# Altium schematic sheet buck_boost.SchDoc
size A4; SheetNumber: 5; SheetTotal: 7
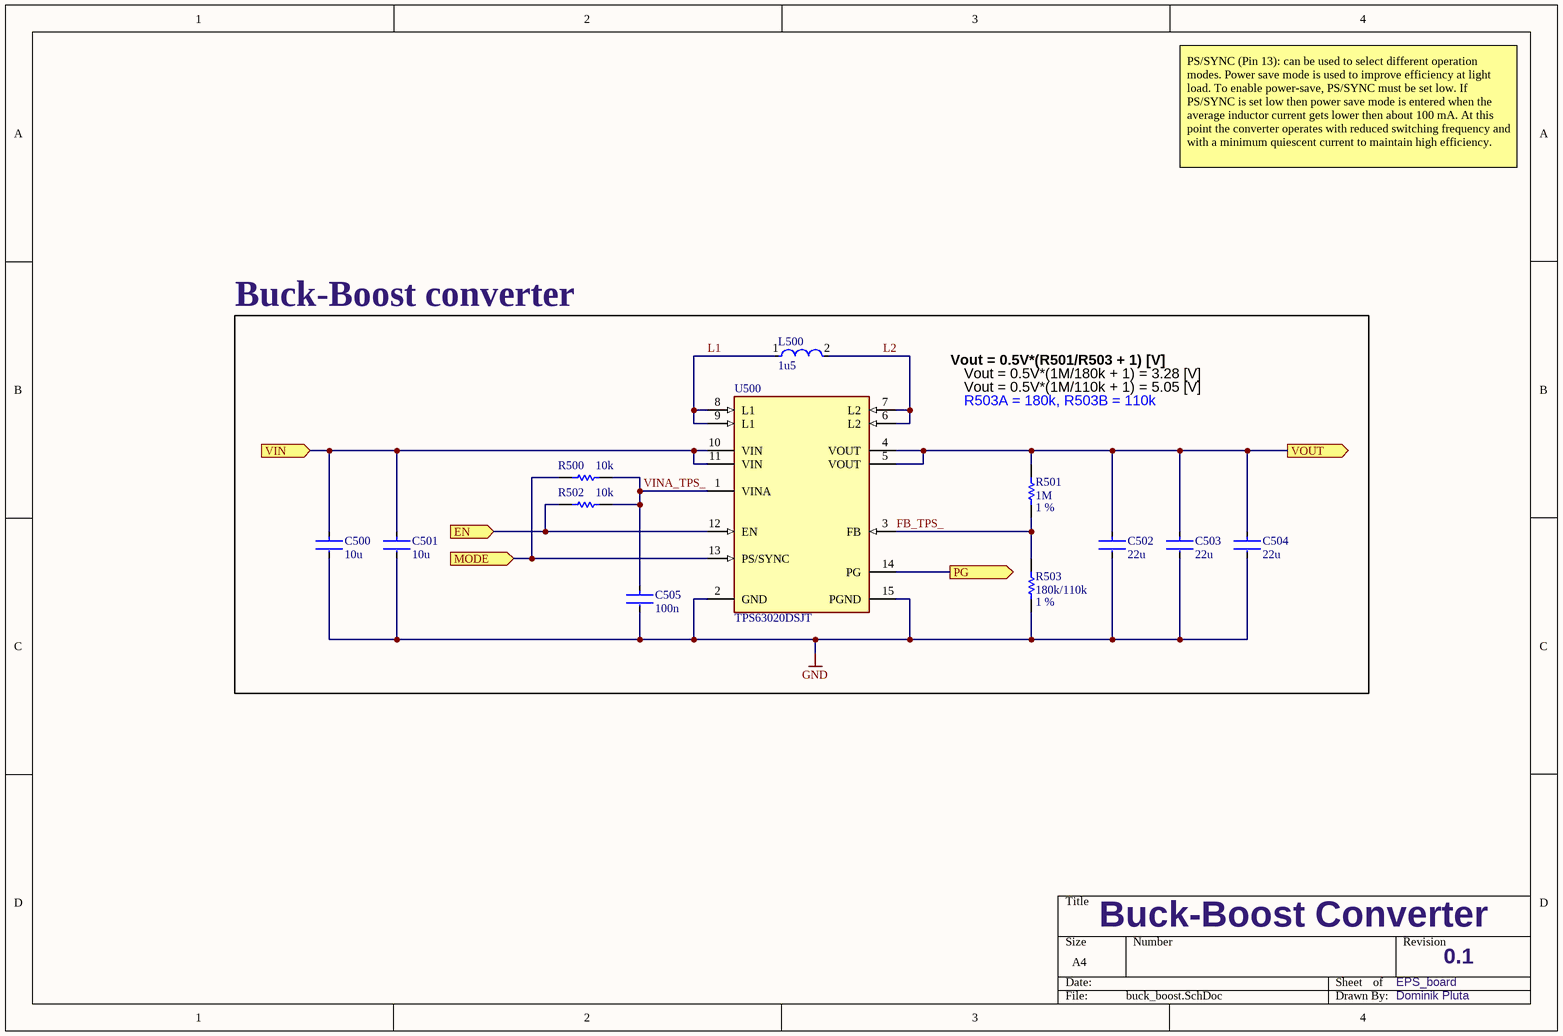
[diagram p0: buck_boost.SchDoc]

## Parts
C500  10u  [FP-C0603C-CF-MFG]
C501  10u  [FP-C0603C-CF-MFG]
C502  22u  [FP-C0603C-CF-MFG]
C503  22u  [FP-C0603C-CF-MFG]
C504  22u  [FP-C0603C-CF-MFG]
C505  100n  [FP-C0603C-CF-MFG]
L500  1u5  [FP-IHLP-1616BZ-FP_1_8545x-MFG]
R500  10k  [RESC0603(1608)_N]
R501  1M  Tolerance: 1 %  [RESC0603(1608)_N]
R502  10k  [RESC0603(1608)_N]
R503  180k/110k  Tolerance: 1 %  [RESC0603(1608)_N]
U500  TPS63020DSJT  [FP-DSJ0014A-MFG]

## Ports
EN (in, see EPS[3B]), MODE (in, see EPS[3B]), PG (out, see EPS[3B]), VIN (in, see EPS[3B]), VOUT (out, see EPS[3B])

## Nets
GND: C500.2 C501.2 C502.2 C503.2 C504.2 C505.2 R503.1 U500.2(GND) U500.15(PGND)
EN: R502.2 U500.12(EN) ; port EN
FB_TPS_: R501.1 R503.2 U500.3(FB)
L1: L500.1 U500.8(L1) U500.9(L1)
L2: L500.2 U500.6(L2) U500.7(L2)
MODE: R500.2 U500.13(PS/SYNC) ; port MODE
PG: U500.14(PG) ; port PG
VIN: C500.1 C501.1 U500.10(VIN) U500.11(VIN) ; port VIN
VINA_TPS_: C505.1 R500.1 R502.1 U500.1(VINA)
VOUT: C502.1 C503.1 C504.1 R501.2 U500.4(VOUT) U500.5(VOUT) ; port VOUT

## Notes on the sheet
- PS/SYNC (Pin 13): can be used to select different operation modes. Power save mode is used to improve efficiency at light load. To enable power-save, PS/SYNC must be set low. If PS/SYNC is set low then power save mode is entered when the average inductor current gets lower then about 100 mA. At this point the converter operates with reduced switching frequency and with a minimum quiescent current to maintain high efficiency.
- Buck-Boost converter
- Vout = 0.5V*(R501/R503 + 1) [V]
- Vout = 0.5V*(1M/180k + 1) = 3.28 [V]
- Vout = 0.5V*(1M/110k + 1) = 5.05 [V]
- R503A = 180k, R503B = 110k
- Buck-Boost Converter
- EPS_board
- 0.1
- Dominik Pluta

## Library data of the parts
C500 C501 = CMP-2006-03061-2: CAP 10 μF 20% 6.3V, 0603, X5R ceramic, eg: GRM188R60J106ME84D; Manufacturer: MURATA; Voltage Rating: 6V3; Capacitance: 10 μF; Tolerance: 20%; Temperature: -55°C to +85°C; RoHS: TRUE; Material: Ceramic; Category: Cap; Package: 0603; ComponentLink2Description: Datasheet; Device Class L1: Passive Components; Device Class L3: Ceramic Capacitors; ComponentLink2URL: https://api.kemet.com/component-edge/download/datasheet/C0603C100J5GACAUTO.pdf; Device Class L2: Capacitors; Manufacturer-part-number: GRM188R60J106ME84D; Temperature Characteristic: X5R
C502-C504 = CMP-2006-03061-2: CAP 22 μF 20% 6.3V, 0603, X5R ceramic, eg: GRM188R60J226MEAOL; Manufacturer: MURATA; Voltage Rating: 6V3; Capacitance: 22 μF; Tolerance: 20%; Temperature: -55°C to +85°C; RoHS: TRUE; Material: Ceramic; Category: Cap; Package: 0603; ComponentLink2Description: Datasheet; Device Class L1: Passive Components; Device Class L3: Ceramic Capacitors; ComponentLink2URL: https://api.kemet.com/component-edge/download/datasheet/C0603C100J5GACAUTO.pdf; Device Class L2: Capacitors; Manufacturer-part-number: GRM188R60J226MEAOL; Temperature Characteristic: X5R
C505 = CMP-2006-03061-2: CAP 0.1 μF, X5R or X7R ceramic; Tolerance: 10; Capacitance: 0.10 μF; Material: Ceramic; Category: Cap; Package: 0603; ComponentLink2Description: Datasheet; Device Class L1: Passive Components; Device Class L3: Ceramic Capacitors; ComponentLink2URL: https://api.kemet.com/component-edge/download/datasheet/C0603C100J5GACAUTO.pdf; Device Class L2: Capacitors
L500 = CMP-02424-000354-1: XFL4020-152ML / 1.5uH 4.6A 15.8mΩ 20%; Test Frequency: 1MHz; DC Resistance (DCR): 15.8mR; Self Resonant Frequency: 59MHz; Shielding: Shielded; Max DC Current: 9.1 A; Core Material: Composite; Inductance Tolerance: 20%; Tolerance: 20%; Termination: SMD/SMT; Max Operating Temperature: 125°C; Saturation Current: 4.6A; Inductance: 1.5uH; Mount: Surface Mount; Case Code (Metric): 4040; Min Operating Temperature: -40°C; Manufacturer Part Number: XFL4020-152ML
R500 R502 = CMP-1012-00081-1: 10k 0.1W 5% 0603 SMD; Case-Metric: 1608; Value: 10000.00 Ohm; Case-EIA: 0603; Tolerance: 5 %; Technology: SMT; Power: 0.1 W
R501 = CMP-1012-00081-1: 1M 0.1W 1% 0603  SMD; Case-Metric: 1608; Value: 1000000.00 Ohm; Case-EIA: 0603; Technology: SMT; Power: 0.1 W
R503 = CMP-1012-00081-1: 180k/110k 0.1W 1% 0603 (1608 Metric)  SMD; Case-Metric: 1608; Value: 18000/110000 Ohm; Case-EIA: 0603; Technology: SMT; Power: 0.1 W
U500 = CMP-2000-07282-2: IC REG BCK BST ADJ 3.5A 14VSON; Manufacturer: Texas Instruments; Switching Frequency: 2400kHz; Output Voltage: 1.2-5.5V; Nominal Supply Current: 25uA; Standoff Height: 0mm; Switching Topology: Buck-Boost; Min Supply Voltage: 1.8V; Output Type: AdjustableProgrammable; Max Junction Temp: +125°C; Number Of Outputs: 1; Output Current: 3A; Max Supply Voltage: 5.5V; ComponentLink2URL: https://www.ti.com/lit/ds/symlink/tps63020.pdf; Ambient Temperature Range High: +85°C; Digikey Description: IC REG BCK BST ADJ 3.5A 14VSON; Ambient Temperature Range Low: -40°C; Manufacturer Part Number: TPS63020DSJT; Automotive: No; Package: DSJ0014A; Category: IC; Temperature Range High: +85°C; Temperature: -40°C to +85°C; Octopart: https://octopart.com/tps63020dsjt-texas+instruments-12976119; Temperature Range Low: -40°C; Device Class L3: Voltage Regulators - Switching; Device Class L2: Power Management ICs; RoHS: TRUE; Lead Free: Yes; Height: 1mm; Device Class L1: Integrated Circuits (ICs); Mouser Description: Voltage Regulators - Switching Regulators 93% Eff Buck-Boost Converter; ComponentLink2Description: Datasheet